# EasyEDA schematic Maharani_Singleboard-project-2.json
TITLE: PCB_KRSTI; REV: 1.0; Date: 2024-12-14; Sheet: 1/1; Company: CyanCloud
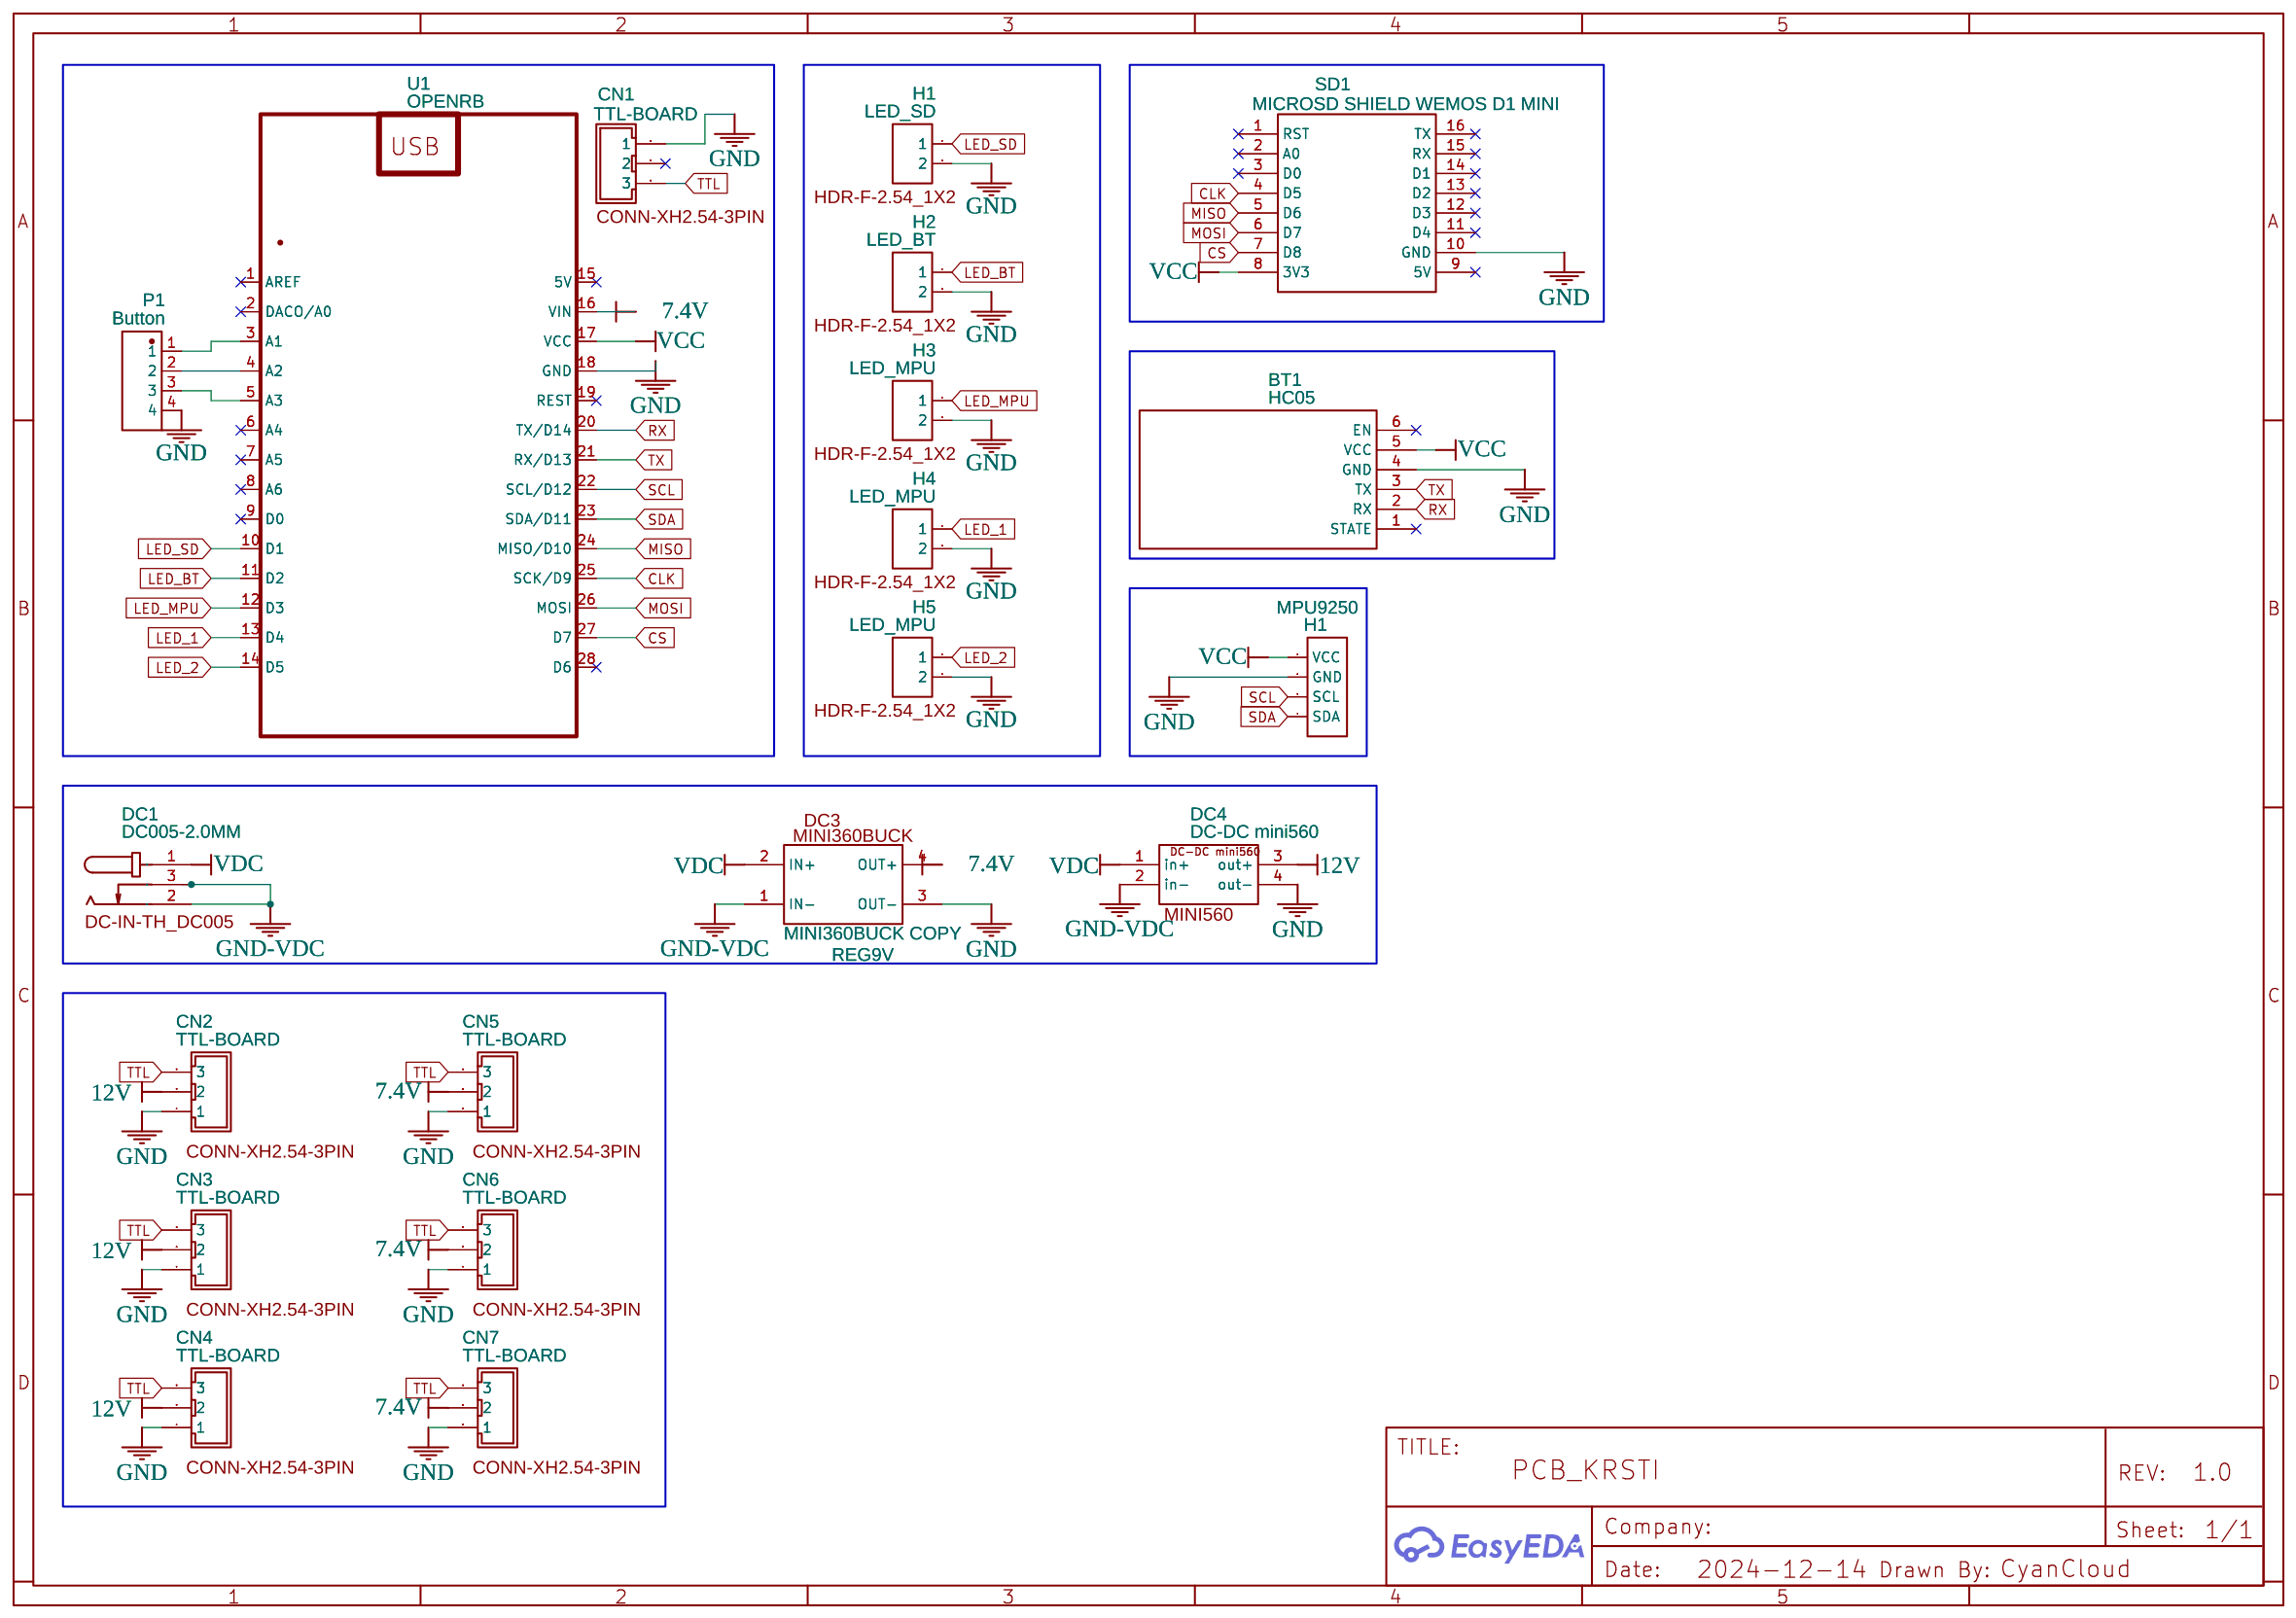
[diagram p0: schematic sheet]

## Parts
BT1  HC05  [HC05]
CN1  TTL-BOARD  [CONN-XH2.54-3PIN]
CN2  TTL-BOARD  [CONN-XH2.54-3PIN]
CN3  TTL-BOARD  [CONN-XH2.54-3PIN]
CN4  TTL-BOARD  [CONN-XH2.54-3PIN]
CN5  TTL-BOARD  [CONN-XH2.54-3PIN]
CN6  TTL-BOARD  [CONN-XH2.54-3PIN]
CN7  TTL-BOARD  [CONN-XH2.54-3PIN]
DC1  DC005-2.0MM  [DC-IN-TH_DC005]
DC4  DC-DC mini560  [MINI560]
H1  LED_SD  [HDR-F-2.54_1X2]
H2  LED_BT  [HDR-F-2.54_1X2]
H3  LED_MPU  [HDR-F-2.54_1X2]
H4  LED_MPU  [HDR-F-2.54_1X2]
H5  LED_MPU  [HDR-F-2.54_1X2]
MPU9250  H1  [HDR-F-2.54_1X4]
P1  Button  [CONN-TH_4P-P2.50-XH2.54-4P]
REG9V  MINI360BUCK COPY  [MINI360BUCK]
SD1  MICROSD SHIELD WEMOS D1 MINI  [MICROSD_SHIELD_WEMOS_D1_MINI]
U1  OPENRB  [OPENRB - QUANTAQ]

## Library data of the parts
BT1 = HC05: Contributor: masm
CN1-CN7 = CONN-XH2.54-3PIN: Contributor: ahmedyerli; Package Display: Yes
DC1 = DC005-2.0MM: Supplier: LCSC; Manufacturer: SOFNG; Supplier Part: C111567; Package Display: Yes
DC4 = DC-DC mini560: Contributor: Ivan711; Package Display: Yes
H1-H5 = HDR-F-2.54_1x2: Supplier Part: C49661; Supplier: LCSC; Contributor: LCEDA_Lib; Package Display: Yes
MPU9250 = HDR-F-2.54_1x4: Supplier Part: C225501; Supplier: LCSC; Contributor: LCEDA_Lib
P1 = XH-2.54-4P: Contributor: LCSC; Supplier: LCSC; Supplier Part: C9900003933; Manufacturer: null; Package Display: No
REG9V = MINI360BUCK COPY: Contributor: Ryan White; sourceId: FRLFXR8qI; Manufacturer Part: Mini360; link: http://ali.pub/399f0z; Package Display: Yes
SD1 = MICROSD SHIELD WEMOS D1 MINI: Supplier Part: Micro SD V1.2.0; Supplier: Aliexpress; Contributor: Slava_SSS; Link: https://fr.aliexpress.com/item/32578362865.html?spm=a2g0o.productlist.0.0.6de91839SYtZCl&algo_pvid=6a0d35c9-b90c-419b-8429-50b5a2e737fc&algo_exp_id=6a0d35c9-b90c-419b-8429-50b5a2e737fc-1&pdp_ext_f=%7B
U1 = OPENRB: Contributor: quantaq

## Nets
7.4V: CN5.2 CN6.2 CN7.2 REG9V.4(OUT+) U1.16(VIN)
12V: CN2.2 CN3.2 CN4.2 DC4.3(out+)
GND: BT1.4(GND) CN1.1 CN2.1 CN3.1 CN4.1 CN5.1 CN6.1 CN7.1 DC4.4(out-) H1.2 H2.2 H3.2 H4.2 H5.2 MPU9250.2(GND) P1.4 REG9V.3(OUT-) SD1.10(GND) U1.18(GND)
GND-VDC: DC1.2 DC1.3 DC4.2(in-) REG9V.1(IN-)
VCC: BT1.5(VCC) MPU9250.1(VCC) SD1.8(3V3) U1.17(VCC)
CLK: SD1.4(D5) U1.25(SCK/D9)
CS: SD1.7(D8) U1.27(D7)
LED_1: H4.1 U1.13(D4)
LED_2: H5.1 U1.14(D5)
LED_BT: H2.1 U1.11(D2)
LED_MPU: H3.1 U1.12(D3)
LED_SD: H1.1 U1.10(D1)
MISO: SD1.5(D6) U1.24(MISO/D10)
MOSI: SD1.6(D7) U1.26(MOSI)
RX: BT1.2(RX) U1.20(TX/D14)
SCL: MPU9250.3(SCL) U1.22(SCL/D12)
SDA: MPU9250.4(SDA) U1.23(SDA/D11)
TTL: CN1.3 CN2.3 CN3.3 CN4.3 CN5.3 CN6.3 CN7.3
TX: BT1.3(TX) U1.21(RX/D13)
VDC: DC1.1 DC4.1(in+) REG9V.2(IN+)
Net-(P1-1): P1.1 U1.3(A1)
Net-(P1-2): P1.2 U1.4(A2)
Net-(P1-3): P1.3 U1.5(A3)

Not connected (* = marked no-connect by the designer): BT1 1(STATE)* 6(EN)*; CN1 2*; SD1 1(RST)* 2(A0)* 3(D0)* 9(5V)* 11(D4)* 12(D3)* 13(D2)* 14(D1)* 15(RX)* 16(TX)*; U1 1(AREF)* 2(DACO/A0)* 6(A4)* 7(A5)* 8(A6)* 9(D0)* 15(5V)* 19(REST)* 28(D6)*
